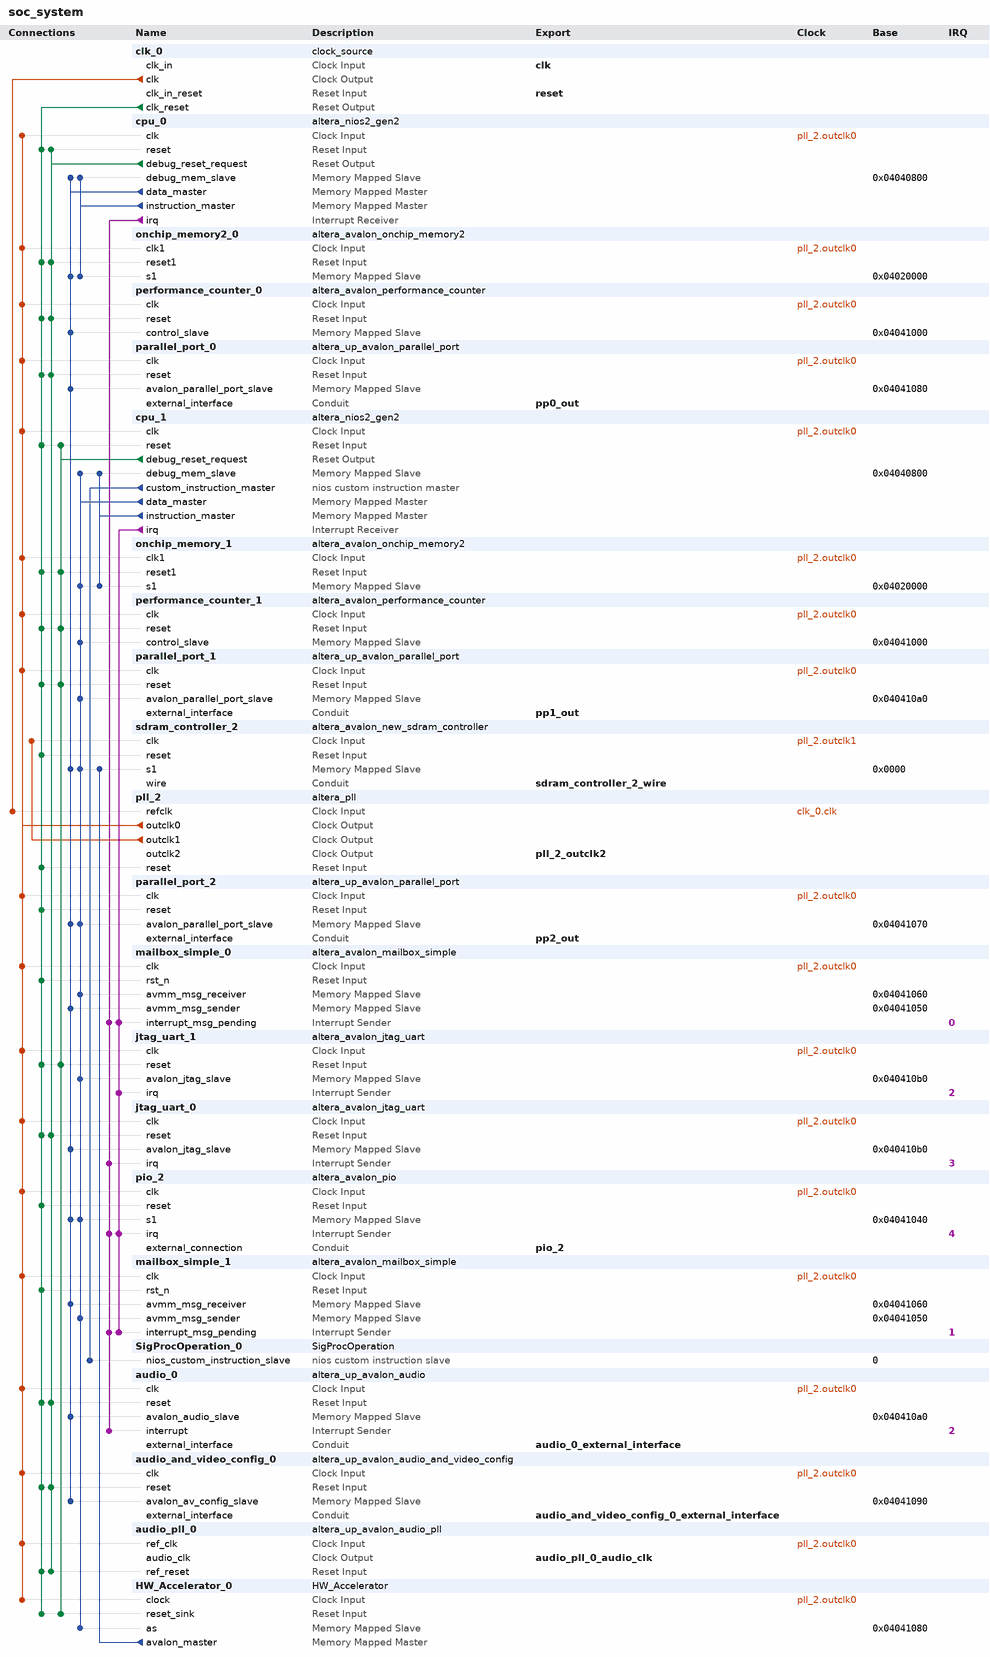
[diagram p0: system contents]
# Platform Designer (Qsys) system soc_system, Cyclone V 5CSEMA5F31C6
# Parameters at their usual value, and those the tool derives, are not listed.
package require -exact qsys 18.1
create_system soc_system
set_project_property DEVICE_FAMILY {Cyclone V}
set_project_property DEVICE 5CSEMA5F31C6

add_instance clk_0 clock_source 18.1
set_instance_parameter_value clk_0 clockFrequency 50000000

add_instance cpu_0 altera_nios2_gen2 18.1
set_instance_parameter_value cpu_0 dcache_size 2048
set_instance_parameter_value cpu_0 exceptionSlave onchip_memory2_0.s1
set_instance_parameter_value cpu_0 icache_size 4096
set_instance_parameter_value cpu_0 impl Fast
set_instance_parameter_value cpu_0 resetSlave onchip_memory2_0.s1

add_instance onchip_memory2_0 altera_avalon_onchip_memory2 18.1
set_instance_parameter_value onchip_memory2_0 dataWidth 32
set_instance_parameter_value onchip_memory2_0 dualPort false
set_instance_parameter_value onchip_memory2_0 initMemContent true
set_instance_parameter_value onchip_memory2_0 initializationFileName onchip_mem.hex
set_instance_parameter_value onchip_memory2_0 memorySize 131072

add_instance performance_counter_0 altera_avalon_performance_counter 18.1
set_instance_parameter_value performance_counter_0 numberOfSections 3

add_instance parallel_port_0 altera_up_avalon_parallel_port 18.0
set_instance_parameter_value parallel_port_0 board DE2-115
set_instance_parameter_value parallel_port_0 capture false
set_instance_parameter_value parallel_port_0 custom_port true
set_instance_parameter_value parallel_port_0 edge Rising
set_instance_parameter_value parallel_port_0 irq false
set_instance_parameter_value parallel_port_0 preset Pushbuttons

add_instance cpu_1 altera_nios2_gen2 18.1
set_instance_parameter_value cpu_1 dcache_size 2048
set_instance_parameter_value cpu_1 exceptionSlave onchip_memory_1.s1
set_instance_parameter_value cpu_1 icache_size 4096
set_instance_parameter_value cpu_1 impl Fast
set_instance_parameter_value cpu_1 resetSlave onchip_memory_1.s1

add_instance onchip_memory_1 altera_avalon_onchip_memory2 18.1
set_instance_parameter_value onchip_memory_1 dataWidth 32
set_instance_parameter_value onchip_memory_1 dualPort false
set_instance_parameter_value onchip_memory_1 initMemContent true
set_instance_parameter_value onchip_memory_1 initializationFileName onchip_mem.hex
set_instance_parameter_value onchip_memory_1 memorySize 131072

add_instance performance_counter_1 altera_avalon_performance_counter 18.1
set_instance_parameter_value performance_counter_1 numberOfSections 3

add_instance parallel_port_1 altera_up_avalon_parallel_port 18.0
set_instance_parameter_value parallel_port_1 board DE2-115
set_instance_parameter_value parallel_port_1 capture false
set_instance_parameter_value parallel_port_1 custom_port true
set_instance_parameter_value parallel_port_1 edge Rising
set_instance_parameter_value parallel_port_1 irq false
set_instance_parameter_value parallel_port_1 preset Pushbuttons

add_instance sdram_controller_2 altera_avalon_new_sdram_controller 18.1
set_instance_parameter_value sdram_controller_2 TAC 5.4
set_instance_parameter_value sdram_controller_2 TRCD 15.0
set_instance_parameter_value sdram_controller_2 TRP 15.0
set_instance_parameter_value sdram_controller_2 casLatency 3
set_instance_parameter_value sdram_controller_2 columnWidth 10
set_instance_parameter_value sdram_controller_2 dataWidth 16
set_instance_parameter_value sdram_controller_2 generateSimulationModel false
set_instance_parameter_value sdram_controller_2 model single_Micron_MT48LC4M32B2_7_chip
set_instance_parameter_value sdram_controller_2 numberOfBanks 4
set_instance_parameter_value sdram_controller_2 numberOfChipSelects 1
set_instance_parameter_value sdram_controller_2 powerUpDelay 100.0
set_instance_parameter_value sdram_controller_2 refreshPeriod 7.8125
set_instance_parameter_value sdram_controller_2 rowWidth 13

add_instance pll_2 altera_pll 18.1
set_instance_parameter_value pll_2 gui_device_speed_grade 1
set_instance_parameter_value pll_2 gui_number_of_clocks 3
set_instance_parameter_value pll_2 gui_operation_mode normal
set_instance_parameter_value pll_2 gui_output_clock_frequency0 50.0
set_instance_parameter_value pll_2 gui_output_clock_frequency1 100.0
set_instance_parameter_value pll_2 gui_output_clock_frequency2 100.0
set_instance_parameter_value pll_2 gui_phase_shift2 -3758
set_instance_parameter_value pll_2 gui_pll_mode {Integer-N PLL}
set_instance_parameter_value pll_2 gui_reference_clock_frequency 50.0
set_instance_parameter_value pll_2 gui_use_locked false

add_instance parallel_port_2 altera_up_avalon_parallel_port 18.0
set_instance_parameter_value parallel_port_2 board DE2-115
set_instance_parameter_value parallel_port_2 capture false
set_instance_parameter_value parallel_port_2 custom_port true
set_instance_parameter_value parallel_port_2 edge Rising
set_instance_parameter_value parallel_port_2 irq false
set_instance_parameter_value parallel_port_2 preset Pushbuttons

add_instance mailbox_simple_0 altera_avalon_mailbox_simple 18.1
set_instance_parameter_value mailbox_simple_0 AWIDTH 2
set_instance_parameter_value mailbox_simple_0 DWIDTH 32
set_instance_parameter_value mailbox_simple_0 MSG_ARRIVAL_NOTIFY 1
set_instance_parameter_value mailbox_simple_0 MSG_SPACE_NOTIFY 0

add_instance jtag_uart_1 altera_avalon_jtag_uart 18.1
set_instance_parameter_value jtag_uart_1 simInteractiveOptions NO_INTERACTIVE_WINDOWS

add_instance jtag_uart_0 altera_avalon_jtag_uart 18.1
set_instance_parameter_value jtag_uart_0 simInteractiveOptions NO_INTERACTIVE_WINDOWS

add_instance pio_2 altera_avalon_pio 18.1
set_instance_parameter_value pio_2 bitClearingEdgeCapReg true
set_instance_parameter_value pio_2 captureEdge true
set_instance_parameter_value pio_2 direction Input
set_instance_parameter_value pio_2 generateIRQ true
set_instance_parameter_value pio_2 irqType EDGE
set_instance_parameter_value pio_2 width 8

add_instance mailbox_simple_1 altera_avalon_mailbox_simple 18.1
set_instance_parameter_value mailbox_simple_1 AWIDTH 2
set_instance_parameter_value mailbox_simple_1 DWIDTH 32
set_instance_parameter_value mailbox_simple_1 MSG_ARRIVAL_NOTIFY 1
set_instance_parameter_value mailbox_simple_1 MSG_SPACE_NOTIFY 0

add_instance SigProcOperation_0 SigProcOperation 1.0

add_instance audio_0 altera_up_avalon_audio 18.0
set_instance_parameter_value audio_0 audio_in true
set_instance_parameter_value audio_0 avalon_bus_type {Memory Mapped}
set_instance_parameter_value audio_0 dw 32

add_instance audio_and_video_config_0 altera_up_avalon_audio_and_video_config 18.0
set_instance_parameter_value audio_and_video_config_0 audio_in {Microphone to ADC}
set_instance_parameter_value audio_and_video_config_0 bit_length 32
set_instance_parameter_value audio_and_video_config_0 board DE1-SoC
set_instance_parameter_value audio_and_video_config_0 line_in_bypass false
set_instance_parameter_value audio_and_video_config_0 sampling_rate {48 kHz}

add_instance audio_pll_0 altera_up_avalon_audio_pll 18.0
set_instance_parameter_value audio_pll_0 gui_refclk 50.0

add_instance HW_Accelerator_0 HW_Accelerator 1.0

# connections
add_connection clk_0.clk pll_2.refclk clock
add_connection pll_2.outclk0 audio_0.clk clock
add_connection pll_2.outclk0 audio_and_video_config_0.clk clock
add_connection pll_2.outclk0 audio_pll_0.ref_clk clock
add_connection pll_2.outclk0 cpu_0.clk clock
add_connection pll_2.outclk0 cpu_1.clk clock
add_connection pll_2.outclk0 HW_Accelerator_0.clock clock
add_connection pll_2.outclk0 jtag_uart_0.clk clock
add_connection pll_2.outclk0 jtag_uart_1.clk clock
add_connection pll_2.outclk0 mailbox_simple_0.clk clock
add_connection pll_2.outclk0 mailbox_simple_1.clk clock
add_connection pll_2.outclk0 onchip_memory2_0.clk1 clock
add_connection pll_2.outclk0 onchip_memory_1.clk1 clock
add_connection pll_2.outclk0 parallel_port_0.clk clock
add_connection pll_2.outclk0 parallel_port_1.clk clock
add_connection pll_2.outclk0 parallel_port_2.clk clock
add_connection pll_2.outclk0 performance_counter_0.clk clock
add_connection pll_2.outclk0 performance_counter_1.clk clock
add_connection pll_2.outclk0 pio_2.clk clock
add_connection pll_2.outclk1 sdram_controller_2.clk clock
add_connection clk_0.clk_reset audio_0.reset reset
add_connection clk_0.clk_reset audio_and_video_config_0.reset reset
add_connection clk_0.clk_reset audio_pll_0.ref_reset reset
add_connection clk_0.clk_reset cpu_0.reset reset
add_connection clk_0.clk_reset cpu_1.reset reset
add_connection clk_0.clk_reset HW_Accelerator_0.reset_sink reset
add_connection clk_0.clk_reset jtag_uart_0.reset reset
add_connection clk_0.clk_reset jtag_uart_1.reset reset
add_connection clk_0.clk_reset mailbox_simple_0.rst_n reset
add_connection clk_0.clk_reset mailbox_simple_1.rst_n reset
add_connection clk_0.clk_reset onchip_memory2_0.reset1 reset
add_connection clk_0.clk_reset onchip_memory_1.reset1 reset
add_connection clk_0.clk_reset parallel_port_0.reset reset
add_connection clk_0.clk_reset parallel_port_1.reset reset
add_connection clk_0.clk_reset parallel_port_2.reset reset
add_connection clk_0.clk_reset performance_counter_0.reset reset
add_connection clk_0.clk_reset performance_counter_1.reset reset
add_connection clk_0.clk_reset pio_2.reset reset
add_connection clk_0.clk_reset pll_2.reset reset
add_connection clk_0.clk_reset sdram_controller_2.reset reset
add_connection cpu_0.debug_reset_request audio_0.reset reset
add_connection cpu_0.debug_reset_request audio_and_video_config_0.reset reset
add_connection cpu_0.debug_reset_request audio_pll_0.ref_reset reset
add_connection cpu_0.debug_reset_request cpu_0.reset reset
add_connection cpu_0.debug_reset_request jtag_uart_0.reset reset
add_connection cpu_0.debug_reset_request onchip_memory2_0.reset1 reset
add_connection cpu_0.debug_reset_request parallel_port_0.reset reset
add_connection cpu_0.debug_reset_request performance_counter_0.reset reset
add_connection cpu_1.debug_reset_request cpu_1.reset reset
add_connection cpu_1.debug_reset_request HW_Accelerator_0.reset_sink reset
add_connection cpu_1.debug_reset_request jtag_uart_1.reset reset
add_connection cpu_1.debug_reset_request onchip_memory_1.reset1 reset
add_connection cpu_1.debug_reset_request parallel_port_1.reset reset
add_connection cpu_1.debug_reset_request performance_counter_1.reset reset
add_connection cpu_0.data_master audio_0.avalon_audio_slave avalon
set_connection_parameter_value cpu_0.data_master/audio_0.avalon_audio_slave baseAddress 0x040410a0
add_connection cpu_0.data_master audio_and_video_config_0.avalon_av_config_slave avalon
set_connection_parameter_value cpu_0.data_master/audio_and_video_config_0.avalon_av_config_slave baseAddress 0x04041090
add_connection cpu_0.data_master cpu_0.debug_mem_slave avalon
set_connection_parameter_value cpu_0.data_master/cpu_0.debug_mem_slave baseAddress 0x04040800
add_connection cpu_0.data_master jtag_uart_0.avalon_jtag_slave avalon
set_connection_parameter_value cpu_0.data_master/jtag_uart_0.avalon_jtag_slave baseAddress 0x040410b0
add_connection cpu_0.data_master mailbox_simple_0.avmm_msg_sender avalon
set_connection_parameter_value cpu_0.data_master/mailbox_simple_0.avmm_msg_sender baseAddress 0x04041050
add_connection cpu_0.data_master mailbox_simple_1.avmm_msg_receiver avalon
set_connection_parameter_value cpu_0.data_master/mailbox_simple_1.avmm_msg_receiver baseAddress 0x04041060
add_connection cpu_0.data_master onchip_memory2_0.s1 avalon
set_connection_parameter_value cpu_0.data_master/onchip_memory2_0.s1 baseAddress 0x04020000
add_connection cpu_0.data_master parallel_port_0.avalon_parallel_port_slave avalon
set_connection_parameter_value cpu_0.data_master/parallel_port_0.avalon_parallel_port_slave baseAddress 0x04041080
add_connection cpu_0.data_master parallel_port_2.avalon_parallel_port_slave avalon
set_connection_parameter_value cpu_0.data_master/parallel_port_2.avalon_parallel_port_slave baseAddress 0x04041070
add_connection cpu_0.data_master performance_counter_0.control_slave avalon
set_connection_parameter_value cpu_0.data_master/performance_counter_0.control_slave baseAddress 0x04041000
add_connection cpu_0.data_master pio_2.s1 avalon
set_connection_parameter_value cpu_0.data_master/pio_2.s1 baseAddress 0x04041040
add_connection cpu_0.data_master sdram_controller_2.s1 avalon
set_connection_parameter_value cpu_0.data_master/sdram_controller_2.s1 baseAddress 0x0000
add_connection cpu_0.instruction_master cpu_0.debug_mem_slave avalon
set_connection_parameter_value cpu_0.instruction_master/cpu_0.debug_mem_slave baseAddress 0x04040800
add_connection cpu_0.instruction_master onchip_memory2_0.s1 avalon
set_connection_parameter_value cpu_0.instruction_master/onchip_memory2_0.s1 baseAddress 0x04020000
add_connection cpu_1.data_master cpu_1.debug_mem_slave avalon
set_connection_parameter_value cpu_1.data_master/cpu_1.debug_mem_slave baseAddress 0x04040800
add_connection cpu_1.data_master HW_Accelerator_0.as avalon
set_connection_parameter_value cpu_1.data_master/HW_Accelerator_0.as baseAddress 0x04041080
add_connection cpu_1.data_master jtag_uart_1.avalon_jtag_slave avalon
set_connection_parameter_value cpu_1.data_master/jtag_uart_1.avalon_jtag_slave baseAddress 0x040410b0
add_connection cpu_1.data_master mailbox_simple_0.avmm_msg_receiver avalon
set_connection_parameter_value cpu_1.data_master/mailbox_simple_0.avmm_msg_receiver baseAddress 0x04041060
add_connection cpu_1.data_master mailbox_simple_1.avmm_msg_sender avalon
set_connection_parameter_value cpu_1.data_master/mailbox_simple_1.avmm_msg_sender baseAddress 0x04041050
add_connection cpu_1.data_master onchip_memory_1.s1 avalon
set_connection_parameter_value cpu_1.data_master/onchip_memory_1.s1 baseAddress 0x04020000
add_connection cpu_1.data_master parallel_port_1.avalon_parallel_port_slave avalon
set_connection_parameter_value cpu_1.data_master/parallel_port_1.avalon_parallel_port_slave baseAddress 0x040410a0
add_connection cpu_1.data_master parallel_port_2.avalon_parallel_port_slave avalon
set_connection_parameter_value cpu_1.data_master/parallel_port_2.avalon_parallel_port_slave baseAddress 0x04041070
add_connection cpu_1.data_master performance_counter_1.control_slave avalon
set_connection_parameter_value cpu_1.data_master/performance_counter_1.control_slave baseAddress 0x04041000
add_connection cpu_1.data_master pio_2.s1 avalon
set_connection_parameter_value cpu_1.data_master/pio_2.s1 baseAddress 0x04041040
add_connection cpu_1.data_master sdram_controller_2.s1 avalon
set_connection_parameter_value cpu_1.data_master/sdram_controller_2.s1 baseAddress 0x0000
add_connection cpu_1.instruction_master cpu_1.debug_mem_slave avalon
set_connection_parameter_value cpu_1.instruction_master/cpu_1.debug_mem_slave baseAddress 0x04040800
add_connection cpu_1.instruction_master onchip_memory_1.s1 avalon
set_connection_parameter_value cpu_1.instruction_master/onchip_memory_1.s1 baseAddress 0x04020000
add_connection HW_Accelerator_0.avalon_master sdram_controller_2.s1 avalon
set_connection_parameter_value HW_Accelerator_0.avalon_master/sdram_controller_2.s1 baseAddress 0x0000
add_connection cpu_0.irq audio_0.interrupt interrupt
set_connection_parameter_value cpu_0.irq/audio_0.interrupt irqNumber 2
add_connection cpu_0.irq jtag_uart_0.irq interrupt
set_connection_parameter_value cpu_0.irq/jtag_uart_0.irq irqNumber 3
add_connection cpu_0.irq mailbox_simple_0.interrupt_msg_pending interrupt
set_connection_parameter_value cpu_0.irq/mailbox_simple_0.interrupt_msg_pending irqNumber 0
add_connection cpu_0.irq mailbox_simple_1.interrupt_msg_pending interrupt
set_connection_parameter_value cpu_0.irq/mailbox_simple_1.interrupt_msg_pending irqNumber 1
add_connection cpu_0.irq pio_2.irq interrupt
set_connection_parameter_value cpu_0.irq/pio_2.irq irqNumber 4
add_connection cpu_1.irq jtag_uart_1.irq interrupt
set_connection_parameter_value cpu_1.irq/jtag_uart_1.irq irqNumber 2
add_connection cpu_1.irq mailbox_simple_0.interrupt_msg_pending interrupt
set_connection_parameter_value cpu_1.irq/mailbox_simple_0.interrupt_msg_pending irqNumber 0
add_connection cpu_1.irq mailbox_simple_1.interrupt_msg_pending interrupt
set_connection_parameter_value cpu_1.irq/mailbox_simple_1.interrupt_msg_pending irqNumber 1
add_connection cpu_1.irq pio_2.irq interrupt
set_connection_parameter_value cpu_1.irq/pio_2.irq irqNumber 4
add_connection cpu_1.custom_instruction_master SigProcOperation_0.nios_custom_instruction_slave nios_custom_instruction
set_connection_parameter_value cpu_1.custom_instruction_master/SigProcOperation_0.nios_custom_instruction_slave CIName sigprocoperation_0
set_connection_parameter_value cpu_1.custom_instruction_master/SigProcOperation_0.nios_custom_instruction_slave baseAddress 0

# exported interfaces
add_interface audio_0_external_interface conduit end
set_interface_property audio_0_external_interface EXPORT_OF audio_0.external_interface
add_interface audio_and_video_config_0_external_interface conduit end
set_interface_property audio_and_video_config_0_external_interface EXPORT_OF audio_and_video_config_0.external_interface
add_interface audio_pll_0_audio_clk clock source
set_interface_property audio_pll_0_audio_clk EXPORT_OF audio_pll_0.audio_clk
add_interface clk clock sink
set_interface_property clk EXPORT_OF clk_0.clk_in
add_interface pio_2 conduit end
set_interface_property pio_2 EXPORT_OF pio_2.external_connection
add_interface pll_2_outclk2 clock source
set_interface_property pll_2_outclk2 EXPORT_OF pll_2.outclk2
add_interface pp0_out conduit end
set_interface_property pp0_out EXPORT_OF parallel_port_0.external_interface
add_interface pp1_out conduit end
set_interface_property pp1_out EXPORT_OF parallel_port_1.external_interface
add_interface pp2_out conduit end
set_interface_property pp2_out EXPORT_OF parallel_port_2.external_interface
add_interface reset reset sink
set_interface_property reset EXPORT_OF clk_0.clk_in_reset
add_interface sdram_controller_2_wire conduit end
set_interface_property sdram_controller_2_wire EXPORT_OF sdram_controller_2.wire

set_interconnect_requirement {$system} qsys_mm.clockCrossingAdapter HANDSHAKE
set_interconnect_requirement {$system} qsys_mm.enableEccProtection FALSE
set_interconnect_requirement {$system} qsys_mm.insertDefaultSlave FALSE
set_interconnect_requirement {$system} qsys_mm.maxAdditionalLatency 1

save_system soc_system.qsys
